# EAGLE design midi2board (EAGLE 7.6.0)
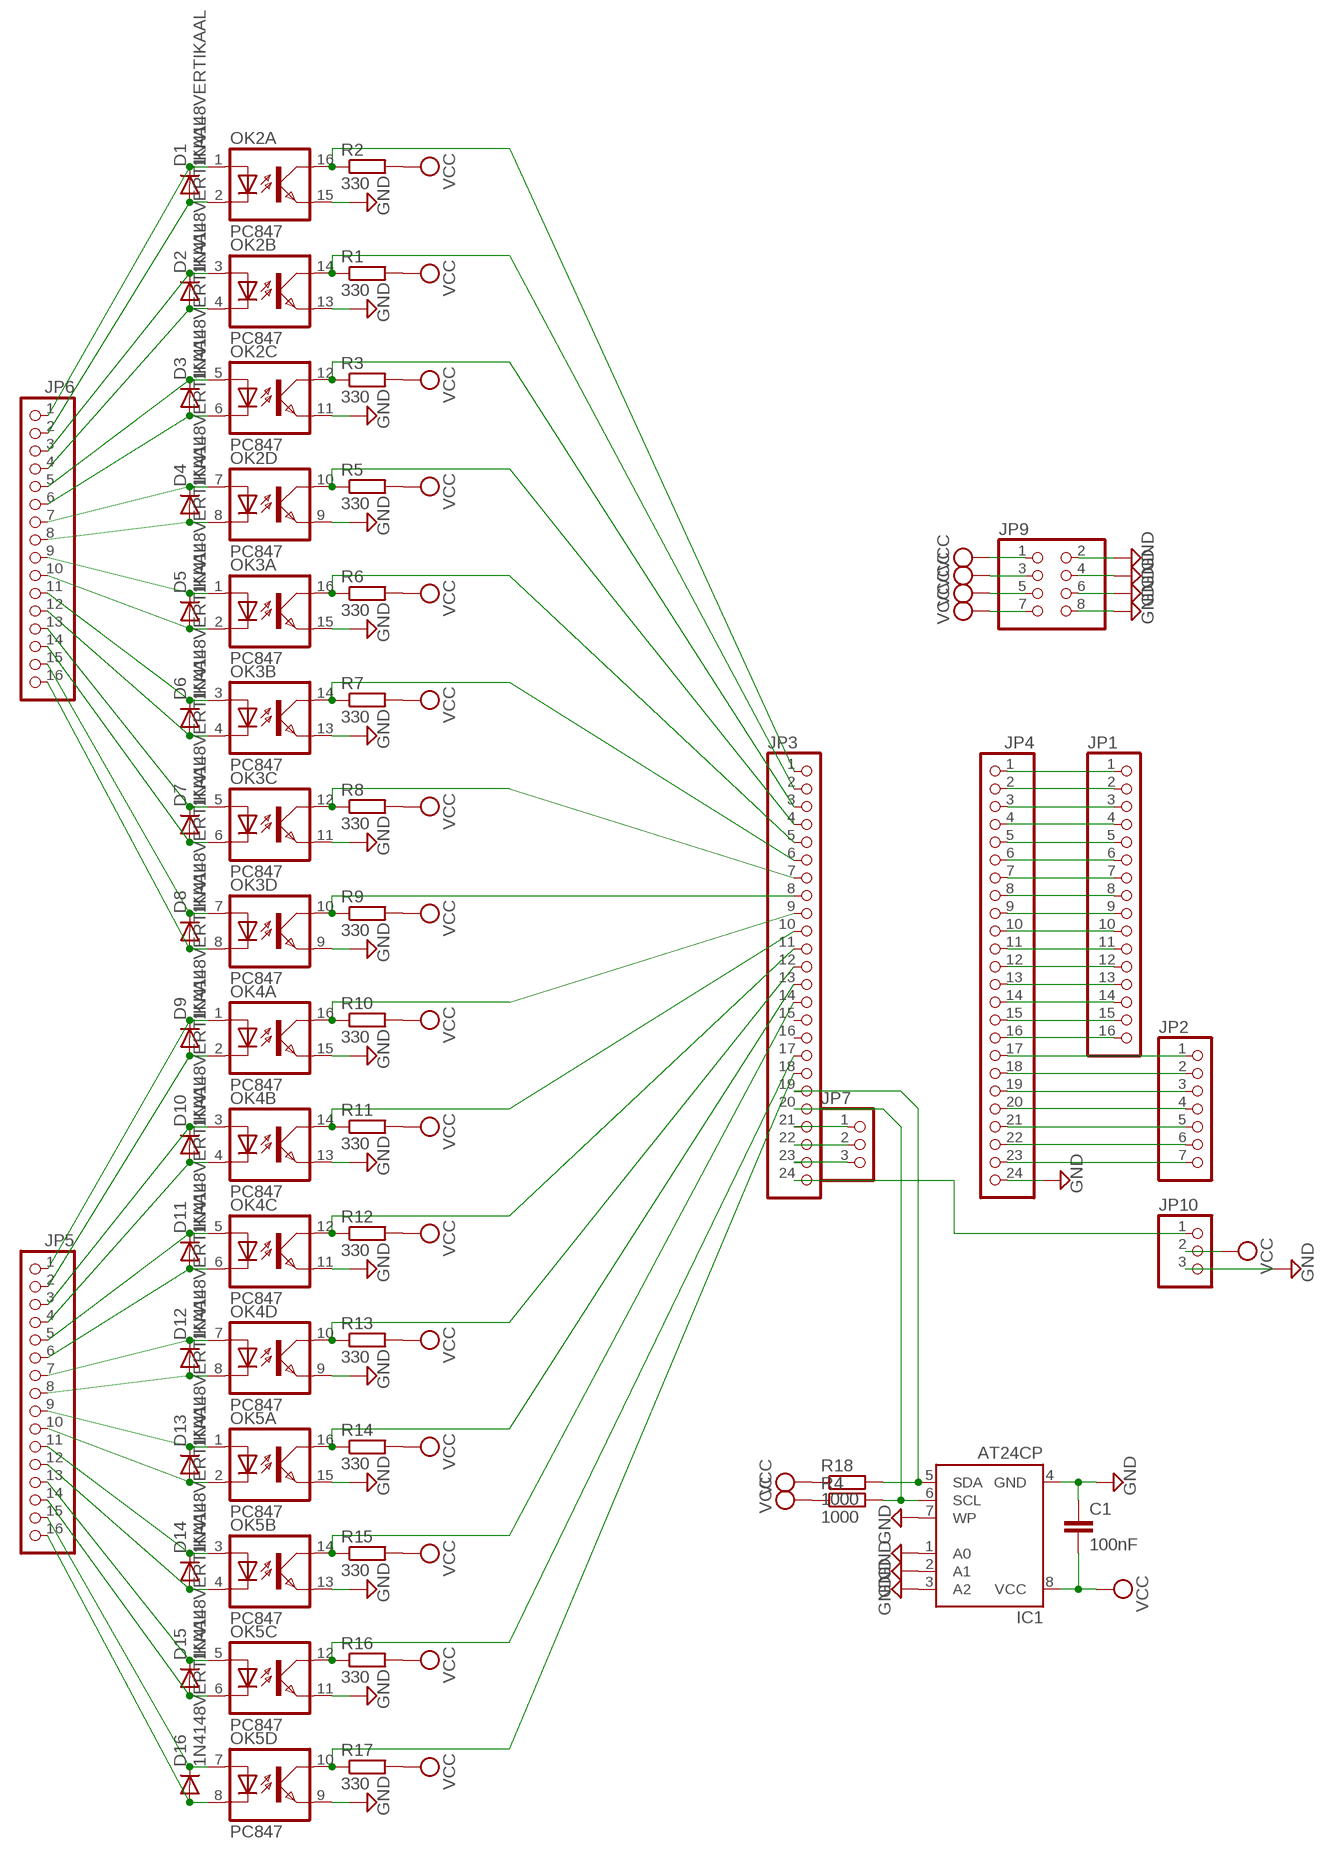
[diagram p0: schematic, sheet 1]

## Parts
C1  100nF  C5/2.5  [C5B2.5]
D1  1N4148VERTIKAAL  [RAD2,5]
D2  1N4148VERTIKAAL  [RAD2,5]
D3  1N4148VERTIKAAL  [RAD2,5]
D4  1N4148VERTIKAAL  [RAD2,5]
D5  1N4148VERTIKAAL  [RAD2,5]
D6  1N4148VERTIKAAL  [RAD2,5]
D7  1N4148VERTIKAAL  [RAD2,5]
D8  1N4148VERTIKAAL  [RAD2,5]
D9  1N4148VERTIKAAL  [RAD2,5]
D10  1N4148VERTIKAAL  [RAD2,5]
D11  1N4148VERTIKAAL  [RAD2,5]
D12  1N4148VERTIKAAL  [RAD2,5]
D13  1N4148VERTIKAAL  [RAD2,5]
D14  1N4148VERTIKAAL  [RAD2,5]
D15  1N4148VERTIKAAL  [RAD2,5]
D16  1N4148VERTIKAAL  [RAD2,5]
IC1  AT24CP  [DIL08]
JP1  PINHD-1X16  [1X16]
JP2  PINHD-1X7  [1X07]
JP3  PINHD-1X24  [1X24]
JP4  PINHD-1X24  [1X24]
JP5  PINHD-1X16  [1X16]
JP6  PINHD-1X16  [1X16]
JP7  PINHD-1X3  [1X03]
JP9  PINHD-2X4  [2X04]
JP10  PINHD-1X3  [1X03]
OK2  PC847  [DIL16]
OK3  PC847  [DIL16]
OK4  PC847  [DIL16]
OK5  PC847  [DIL16]
R1  330  R-EU_0207/10  [0207/10]
R2  330  R-EU_0207/10  [0207/10]
R3  330  R-EU_0207/10  [0207/10]
R4  1000  R-EU_0207/10  [0207/10]
R5  330  R-EU_0207/10  [0207/10]
R6  330  R-EU_0207/10  [0207/10]
R7  330  R-EU_0207/10  [0207/10]
R8  330  R-EU_0207/10  [0207/10]
R9  330  R-EU_0207/10  [0207/10]
R10  330  R-EU_0207/10  [0207/10]
R11  330  R-EU_0207/10  [0207/10]
R12  330  R-EU_0207/10  [0207/10]
R13  330  R-EU_0207/10  [0207/10]
R14  330  R-EU_0207/10  [0207/10]
R15  330  R-EU_0207/10  [0207/10]
R16  330  R-EU_0207/10  [0207/10]
R17  330  R-EU_0207/10  [0207/10]
R18  1000  R-EU_0207/10  [0207/10]

## Nets
GND: C1.1 IC1.1(A0) IC1.2(A1) IC1.3(A2) IC1.4(GND) IC1.7(WP) JP4.24 JP9.2 JP9.4 JP9.6 JP9.8 JP10.3 OK2.9(D:EMIT) OK2.11(C:EMIT) OK2.13(B:EMIT) OK2.15(A:EMIT) OK3.9(D:EMIT) OK3.11(C:EMIT) OK3.13(B:EMIT) OK3.15(A:EMIT) OK4.9(D:EMIT) OK4.11(C:EMIT) OK4.13(B:EMIT) OK4.15(A:EMIT) OK5.9(D:EMIT) OK5.11(C:EMIT) OK5.13(B:EMIT) OK5.15(A:EMIT)
N$1: JP2.1 JP4.17
N$2: D1.C JP6.1 OK2.1(A:A)
N$3: D1.A JP6.2 OK2.2(A:C)
N$4: JP2.2 JP4.18
N$5: JP2.3 JP4.19
N$6: D2.C JP6.3 OK2.3(B:A)
N$7: D2.A JP6.4 OK2.4(B:C)
N$8: JP2.4 JP4.20
N$9: D3.C JP6.5 OK2.5(C:A)
N$10: D3.A JP6.6 OK2.6(C:C)
N$11: D4.C JP6.7 OK2.7(D:A)
N$12: D4.A JP6.8 OK2.8(D:C)
N$13: D5.C JP6.9 OK3.1(A:A)
N$14: D5.A JP6.10 OK3.2(A:C)
N$15: D6.C JP6.11 OK3.3(B:A)
N$16: D6.A JP6.12 OK3.4(B:C)
N$17: D7.C JP6.13 OK3.5(C:A)
N$18: D7.A JP6.14 OK3.6(C:C)
N$19: D8.C JP6.15 OK3.7(D:A)
N$20: D8.A JP6.16 OK3.8(D:C)
N$21: D9.C JP5.1 OK4.1(A:A)
N$22: D9.A JP5.2 OK4.2(A:C)
N$23: D10.C JP5.3 OK4.3(B:A)
N$24: D10.A JP5.4 OK4.4(B:C)
N$25: D11.C JP5.5 OK4.5(C:A)
N$26: D11.A JP5.6 OK4.6(C:C)
N$27: D12.C JP5.7 OK4.7(D:A)
N$28: D12.A JP5.8 OK4.8(D:C)
N$29: D13.C JP5.9 OK5.1(A:A)
N$30: D13.A JP5.10 OK5.2(A:C)
N$31: D14.C JP5.11 OK5.3(B:A)
N$32: D14.A JP5.12 OK5.4(B:C)
N$33: D15.C JP5.13 OK5.5(C:A)
N$34: D15.A JP5.14 OK5.6(C:C)
N$35: D16.C JP5.15 OK5.7(D:A)
N$36: D16.A JP5.16 OK5.8(D:C)
N$37: JP3.2 OK2.14(B:COL) R1.1
N$38: JP3.1 OK2.16(A:COL) R2.1
N$39: JP3.3 OK2.12(C:COL) R3.1
N$40: JP3.4 OK2.10(D:COL) R5.1
N$41: JP3.5 OK3.16(A:COL) R6.1
N$42: JP3.6 OK3.14(B:COL) R7.1
N$43: JP3.7 OK3.12(C:COL) R8.1
N$44: JP3.8 OK3.10(D:COL) R9.1
N$45: JP3.9 OK4.16(A:COL) R10.1
N$46: JP3.10 OK4.14(B:COL) R11.1
N$47: JP3.11 OK4.12(C:COL) R12.1
N$48: JP3.12 OK4.10(D:COL) R13.1
N$49: JP3.13 OK5.16(A:COL) R14.1
N$50: JP3.14 OK5.14(B:COL) R15.1
N$51: JP3.17 OK5.12(C:COL) R16.1
N$52: JP3.18 OK5.10(D:COL) R17.1
N$53: JP3.24 JP10.1
N$54: JP3.21 JP7.1
N$55: JP3.22 JP7.2
N$56: JP3.23 JP7.3
N$69: JP1.1 JP4.1
N$70: JP1.2 JP4.2
N$71: JP1.3 JP4.3
N$72: JP1.4 JP4.4
N$73: JP1.5 JP4.5
N$74: JP1.6 JP4.6
N$75: JP1.7 JP4.7
N$76: JP1.8 JP4.8
N$77: JP1.9 JP4.9
N$78: JP1.10 JP4.10
N$79: JP1.11 JP4.11
N$80: JP1.12 JP4.12
N$81: JP1.13 JP4.13
N$82: JP1.14 JP4.14
N$83: JP1.15 JP4.15
N$84: JP1.16 JP4.16
N$85: JP2.5 JP4.21
N$86: JP2.6 JP4.22
N$87: JP2.7 JP4.23
N$88: IC1.5(SDA) JP3.19 R18.2
N$89: IC1.6(SCL) JP3.20 R4.2
VCC: C1.2 IC1.8(VCC) JP9.1 JP9.3 JP9.5 JP9.7 JP10.2 R1.2 R2.2 R3.2 R4.1 R5.2 R6.2 R7.2 R8.2 R9.2 R10.2 R11.2 R12.2 R13.2 R14.2 R15.2 R16.2 R17.2 R18.1
Unconnected: JP3.15 JP3.16

## Library data of the parts
C1 = capacitor-wima:C: CAPACITOR naming: grid - package width
D1-D16 = diode:1N4148: DIODE high speed (Philips)
IC1 = atmel:AT24C*: 2-wire serial EEPROM; MPN: AT24C1024BW-SH-B; OC_FARNELL: 1362646; OC_NEWARK: 03P2044
JP1 JP5 JP6 = pinhead:PINHD-1X16: PIN HEADER
JP2 = pinhead:PINHD-1X7: PIN HEADER
JP3 JP4 = pinhead:PINHD-1X24: PIN HEADER
JP7 JP10 = pinhead:PINHD-1X3: PIN HEADER
JP9 = pinhead:PINHD-2X4: PIN HEADER
OK2-OK5 = optocoupler:PC847: SHARP OPTO COUPLER; OC_FARNELL: 9707735; OC_NEWARK: unknown
R1-R18 = rcl:R-EU_: RESISTOR, European symbol

## Board
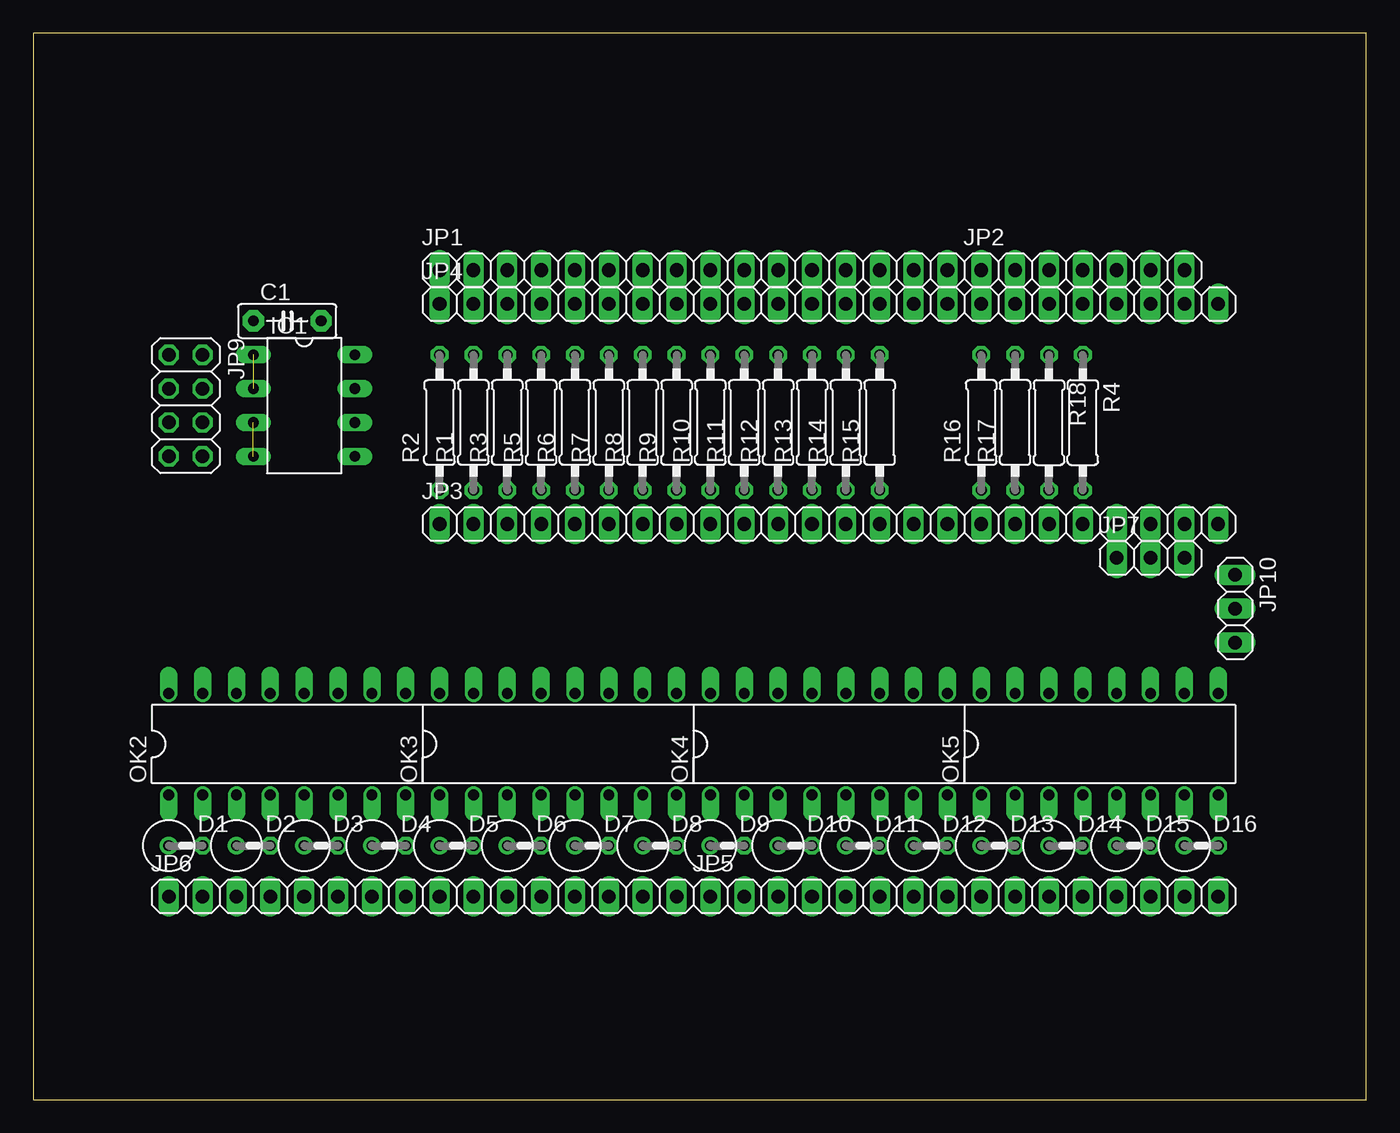
[diagram p1: board, top side]
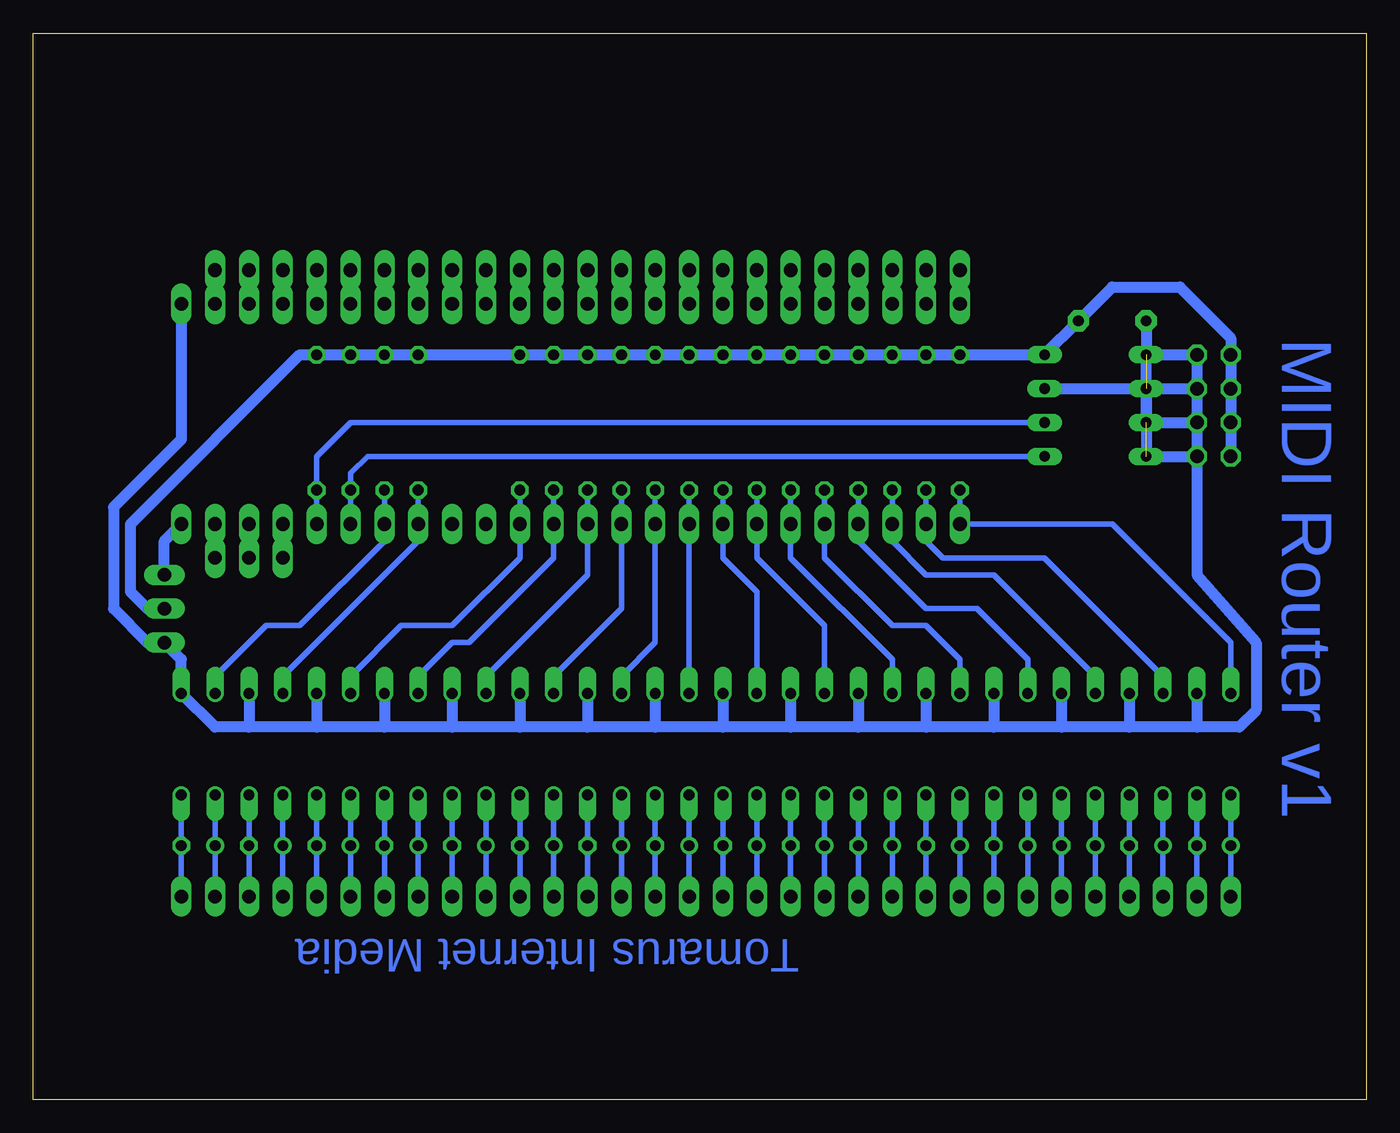
[diagram p2: board, bottom side, seen from below]

Size 100 x 80 mm. Coordinates in mm from the lower left corner, seen from the top.
Outline: 0,0 100,0 100,80 0,80 0,0
Copper layers (1*16): Top 0.035mm / dielectric 1.5mm / Bottom 0.035mm
Design rules "default": minimum track width 10mil, minimum drill 24mil, track to track 8mil, track to pad 8mil, pad to pad 8mil, via to via 8mil, smd to smd 8mil, copper to edge 40mil, drill to drill 8mil, minimum pad ring 10mil, minimum via ring 8mil, stop-mask expansion 4mil, vias tented up to drill 0mil, thermal gap 10mil

### Footprints (pad centres in the part's own frame; a part is rotated, then mirrored left to right if it is on the bottom)
C5B2.5 = drill 0.813 pad 1.6 octagon: 1 -2.54,0; 2 2.54,0
RAD2,5 = drill 0.813 octagon: A 1.27,0 | drill 0.813: C -1.27,0
DIL08 = drill 0.813 long: 1 -3.81,-3.81; 2 -1.27,-3.81; 3 1.27,-3.81; 4 3.81,-3.81; 5 3.81,3.81; 6 1.27,3.81; 7 -1.27,3.81; 8 -3.81,3.81
1X16 = drill 1.016 long: 1 -19.05,0; 2 -16.51,0; 3 -13.97,0; 4 -11.43,0; 5 -8.89,0; 6 -6.35,0; 7 -3.81,0; 8 -1.27,0; 9 1.27,0; 10 3.81,0; 11 6.35,0; 12 8.89,0; 13 11.43,0; 14 13.97,0; 15 16.51,0; 16 19.05,0
1X07 = drill 1.016 long: 1 -7.62,0; 2 -5.08,0; 3 -2.54,0; 4 0,0; 5 2.54,0; 6 5.08,0; 7 7.62,0
1X24 = drill 1.016 long: 1 -29.21,0; 2 -26.67,0; 3 -24.13,0; 4 -21.59,0; 5 -19.05,0; 6 -16.51,0; 7 -13.97,0; 8 -11.43,0; 9 -8.89,0; 10 -6.35,0; 11 -3.81,0; 12 -1.27,0; 13 1.27,0; 14 3.81,0; 15 6.35,0; 16 8.89,0; 17 11.43,0; 18 13.97,0; 19 16.51,0; 20 19.05,0; 21 21.59,0; 22 24.13,0; 23 26.67,0; 24 29.21,0
1X03 = drill 1.016 long: 1 -2.54,0; 2 0,0; 3 2.54,0
2X04 = drill 1.016 octagon: 1 -3.81,-1.27; 2 -3.81,1.27; 3 -1.27,-1.27; 4 -1.27,1.27; 5 1.27,-1.27; 6 1.27,1.27; 7 3.81,-1.27; 8 3.81,1.27
DIL16 = drill 0.813 offset: 1 -8.89,-3.81; 2 -6.35,-3.81; 3 -3.81,-3.81; 4 -1.27,-3.81; 5 1.27,-3.81; 6 3.81,-3.81; 7 6.35,-3.81; 8 8.89,-3.81; 9 8.89,3.81; 10 6.35,3.81; 11 3.81,3.81; 12 1.27,3.81; 13 -1.27,3.81; 14 -3.81,3.81; 15 -6.35,3.81; 16 -8.89,3.81
0207/10 = drill 0.813 octagon: 1 -5.08,0; 2 5.08,0

### Placement (x,y rotation side)
C1  19.05,58.42 0 top
D1  11.43,19.05 0 top
D2  16.51,19.05 0 top
D3  21.59,19.05 0 top
D4  26.67,19.05 0 top
D5  31.75,19.05 0 top
D6  36.83,19.05 0 top
D7  41.91,19.05 0 top
D8  46.99,19.05 0 top
D9  52.07,19.05 0 top
D10  57.15,19.05 0 top
D11  62.23,19.05 0 top
D12  67.31,19.05 0 top
D13  72.39,19.05 0 top
D14  77.47,19.05 0 top
D15  82.55,19.05 0 top
D16  87.63,19.05 0 top
IC1  20.32,52.07 270 top
JP1  49.53,62.23 0 top
JP2  78.74,62.23 0 top
JP3  59.69,43.18 0 top
JP4  59.69,59.69 0 top
JP5  69.85,15.24 0 top
JP6  29.21,15.24 0 top
JP7  83.82,40.64 0 top
JP9  11.43,52.07 270 top
JP10  90.17,36.83 270 top
OK2  19.05,26.67 0 top
OK3  39.37,26.67 0 top
OK4  59.69,26.67 0 top
OK5  80.01,26.67 0 top
R1  33.02,50.8 90 top
R2  30.48,50.8 90 top
R3  35.56,50.8 90 top
R4  78.74,50.8 270 top
R5  38.1,50.8 90 top
R6  40.64,50.8 90 top
R7  43.18,50.8 90 top
R8  45.72,50.8 90 top
R9  48.26,50.8 90 top
R10  50.8,50.8 90 top
R11  53.34,50.8 90 top
R12  55.88,50.8 90 top
R13  58.42,50.8 90 top
R14  60.96,50.8 90 top
R15  63.5,50.8 90 top
R16  71.12,50.8 90 top
R17  73.66,50.8 90 top
R18  76.2,50.8 270 top

### Tracks (layer width: path | path; a pad name or v marks a point on that pad's centre or on a via)
GND  (2 unrouted)
  Bottom 0.813: C1.1 IC1.1 | IC1.1 JP9.2 JP9.4 | JP9.4 JP9.6 | JP9.6 JP9.8 | JP9.8 12.7,39.37 8.26,34.29 8.26,29.21 9.53,27.94 12.7,27.94 | 12.7,27.94 17.78,27.94 | 17.78,27.94 22.86,27.94 | 22.86,27.94 27.94,27.94 | 27.94,27.94 33.02,27.94 | 33.02,27.94 38.1,27.94 | 38.1,27.94 43.18,27.94 | 43.18,27.94 48.26,27.94 | 48.26,27.94 53.34,27.94 | 53.34,27.94 58.42,27.94 | 58.42,27.94 63.5,27.94 | 63.5,27.94 68.58,27.94 | 68.58,27.94 73.66,27.94 | 73.66,27.94 78.74,27.94 | 78.74,27.94 83.82,27.94 | 83.82,27.94 86.36,27.94 OK5.9 88.9,33.02 JP10.3 91.44,34.29 93.98,36.83 93.98,44.45 88.9,49.53 JP4.24 | OK2.15 12.7,27.94 | OK2.13 17.78,27.94 | OK2.11 22.86,27.94 | OK2.9 27.94,27.94 | OK3.15 33.02,27.94 | OK3.13 38.1,27.94 | OK3.11 43.18,27.94 | OK3.9 48.26,27.94 | OK4.15 53.34,27.94 | OK4.13 58.42,27.94 | OK4.11 63.5,27.94 | OK4.9 68.58,27.94 | OK5.15 73.66,27.94 | OK5.13 78.74,27.94 | OK5.11 83.82,27.94 | JP9.8 IC1.4 IC1.2 | JP9.6 IC1.3 IC1.2 | IC1.2 JP9.4 | IC1.7 IC1.2 | IC1.2 IC1.1
N$1
  Bottom 0.406: JP2.1 JP4.17
N$2
  Bottom 0.406: OK2.1 D1.C JP6.1
N$3
  Bottom 0.406: JP6.2 D1.A OK2.2
N$4
  Bottom 0.406: JP4.18 JP2.2
N$5
  Bottom 0.406: JP2.3 JP4.19
N$6
  Bottom 0.406: OK2.3 D2.C JP6.3
N$7
  Bottom 0.406: JP6.4 D2.A OK2.4
N$8
  Bottom 0.406: JP4.20 JP2.4
N$9
  Bottom 0.406: OK2.5 D3.C JP6.5
N$10
  Bottom 0.406: JP6.6 D3.A OK2.6
N$11
  Bottom 0.406: OK2.7 D4.C JP6.7
N$12
  Bottom 0.406: JP6.8 D4.A OK2.8
N$13
  Bottom 0.406: OK3.1 D5.C JP6.9
N$14
  Bottom 0.406: JP6.10 D5.A OK3.2
N$15
  Bottom 0.406: OK3.3 D6.C JP6.11
N$16
  Bottom 0.406: JP6.12 D6.A OK3.4
N$17
  Bottom 0.406: OK3.5 D7.C JP6.13
N$18
  Bottom 0.406: JP6.14 D7.A OK3.6
N$19
  Bottom 0.406: OK3.7 D8.C JP6.15
N$20
  Bottom 0.406: JP6.16 D8.A OK3.8
N$21
  Bottom 0.406: OK4.1 D9.C JP5.1
N$22
  Bottom 0.406: JP5.2 D9.A OK4.2
N$23
  Bottom 0.406: OK4.3 D10.C JP5.3
N$24
  Bottom 0.406: JP5.4 D10.A OK4.4
N$25
  Bottom 0.406: OK4.5 D11.C JP5.5
N$26
  Bottom 0.406: JP5.6 D11.A OK4.6
N$27
  Bottom 0.406: OK4.7 D12.C JP5.7
N$28
  Bottom 0.406: JP5.8 D12.A OK4.8
N$29
  Bottom 0.406: OK5.1 D13.C JP5.9
N$30
  Bottom 0.406: JP5.10 D13.A OK5.2
N$31
  Bottom 0.406: OK5.3 D14.C JP5.11
N$32
  Bottom 0.406: JP5.12 D14.A OK5.4
N$33
  Bottom 0.406: OK5.5 D15.C JP5.13
N$34
  Bottom 0.406: JP5.14 D15.A OK5.6
N$35
  Bottom 0.406: OK5.7 D16.C JP5.15
N$36
  Bottom 0.406: JP5.16 D16.A OK5.8
N$37
  Bottom 0.406: R1.1 JP3.2 33.02,41.91 31.75,40.64 24.13,40.64 15.24,31.75 OK2.14
N$38
  Bottom 0.406: R2.1 JP3.1 19.05,43.18 10.16,34.29 OK2.16
N$39
  Bottom 0.406: R3.1 JP3.3 35.56,41.91 33.02,39.37 27.94,39.37 20.32,31.75 OK2.12
N$40
  Bottom 0.406: R5.1 JP3.4 38.1,41.91 33.02,36.83 29.21,36.83 25.4,33.02 OK2.10
N$41
  Bottom 0.406: R6.1 JP3.5 40.64,40.64 35.56,35.56 33.02,35.56 30.48,33.02 OK3.16
N$42
  Bottom 0.406: R7.1 JP3.6 43.18,40.64 35.56,33.02 OK3.14
N$43
  Bottom 0.406: R8.1 JP3.7 45.72,40.64 40.64,35.56 OK3.12
N$44
  Bottom 0.406: R9.1 JP3.8 48.26,40.64 45.72,38.1 OK3.10
N$45
  Bottom 0.406: R10.1 JP3.9 OK4.16
N$46
  Bottom 0.406: R11.1 JP3.10 53.34,34.29 55.88,31.75 OK4.14
N$47
  Bottom 0.406: R12.1 JP3.11 55.88,36.83 60.96,31.75 OK4.12
N$48
  Bottom 0.406: R13.1 JP3.12 58.42,39.37 66.04,31.75 OK4.10
N$49
  Bottom 0.406: R14.1 JP3.13 60.96,40.64 67.31,34.29 68.58,34.29 71.12,31.75 OK5.16
N$50
  Bottom 0.406: R15.1 JP3.14 63.5,40.64 68.58,35.56 72.39,35.56 76.2,31.75 OK5.14
N$51
  Bottom 0.406: R16.1 JP3.17 71.12,41.91 81.28,31.75 OK5.12
N$52
  Bottom 0.406: R17.1 JP3.18 73.66,41.91 80.01,35.56 82.55,35.56 86.36,31.75 OK5.10
N$53
  Bottom 0.813: JP10.1 90.17,41.91 JP3.24
N$54
  Bottom 0.406: JP7.1 JP3.21
N$55
  Bottom 0.406: JP3.22 JP7.2
N$56
  Bottom 0.406: JP7.3 JP3.23
N$69
  Bottom 0.406: JP1.1 JP4.1
N$70
  Bottom 0.406: JP4.2 JP1.2
N$71
  Bottom 0.406: JP1.3 JP4.3
N$72
  Bottom 0.406: JP4.4 JP1.4
N$73
  Bottom 0.406: JP1.5 JP4.5
N$74
  Bottom 0.406: JP4.6 JP1.6
N$75
  Bottom 0.406: JP1.7 JP4.7
N$76
  Bottom 0.406: JP4.8 JP1.8
N$77
  Bottom 0.406: JP1.9 JP4.9
N$78
  Bottom 0.406: JP4.10 JP1.10
N$79
  Bottom 0.406: JP4.11 JP1.11
N$80
  Bottom 0.406: JP1.12 JP4.12
N$81
  Bottom 0.406: JP4.13 JP1.13
N$82
  Bottom 0.406: JP1.14 JP4.14
N$83
  Bottom 0.406: JP4.15 JP1.15
N$84
  Bottom 0.406: JP1.16 JP4.16
N$85
  Bottom 0.406: JP2.5 JP4.21
N$86
  Bottom 0.406: JP4.22 JP2.6
N$87
  Bottom 0.406: JP2.7 JP4.23
N$88
  Bottom 0.406: JP3.19 R18.2 76.2,46.99 74.93,48.26 IC1.5
N$89
  Bottom 0.406: JP3.20 R4.2 78.74,48.26 76.2,50.8 IC1.6
VCC
  Bottom 0.813: JP10.2 91.44,36.83 92.71,38.1 92.71,43.18 80.01,55.88 R4.1 R18.1 R17.2 R16.2 R15.2 R14.2 R13.2 R12.2 R11.2 R10.2 R9.2 R8.2 R7.2 R6.2 R5.2 R3.2 R1.2 R2.2 IC1.8 C1.2 19.05,60.96 13.97,60.96 10.16,57.15 JP9.1 JP9.3 JP9.5 JP9.7

### Text on the board
Bottom: MIDI Router v1 | Tomarus Internet Media